# EAGLE schematic Terminierung_RS485_RJ45_Pads (EAGLE 8.5.1)
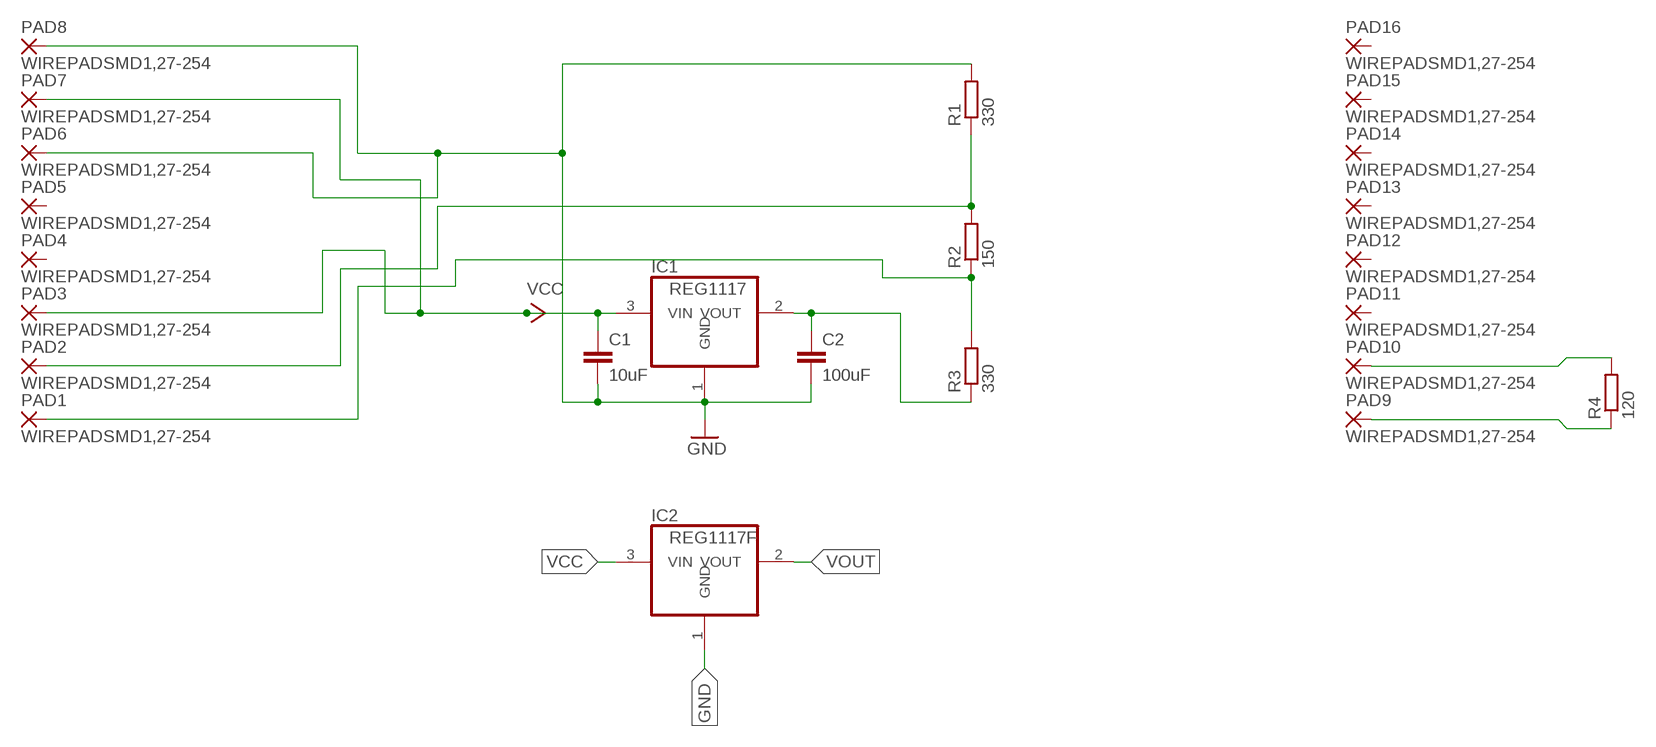
[diagram p0: schematic, sheet 1]

## Parts
C1  10uF  C-EUC0805K  [C0805K]
C2  100uF  C-EUC0805K  [C0805K]
IC1  REG1117  [SOT223]
IC2  REG1117F  [DD-3]
PAD1  WIREPADSMD1,27-254  [SMD1,27-2,54]
PAD2  WIREPADSMD1,27-254  [SMD1,27-2,54]
PAD3  WIREPADSMD1,27-254  [SMD1,27-2,54]
PAD4  WIREPADSMD1,27-254  [SMD1,27-2,54]
PAD5  WIREPADSMD1,27-254  [SMD1,27-2,54]
PAD6  WIREPADSMD1,27-254  [SMD1,27-2,54]
PAD7  WIREPADSMD1,27-254  [SMD1,27-2,54]
PAD8  WIREPADSMD1,27-254  [SMD1,27-2,54]
PAD9  WIREPADSMD1,27-254  [SMD1,27-2,54]
PAD10  WIREPADSMD1,27-254  [SMD1,27-2,54]
PAD11  WIREPADSMD1,27-254  [SMD1,27-2,54]
PAD12  WIREPADSMD1,27-254  [SMD1,27-2,54]
PAD13  WIREPADSMD1,27-254  [SMD1,27-2,54]
PAD14  WIREPADSMD1,27-254  [SMD1,27-2,54]
PAD15  WIREPADSMD1,27-254  [SMD1,27-2,54]
PAD16  WIREPADSMD1,27-254  [SMD1,27-2,54]
R1  330  R-EU_R0805  [R0805]
R2  150  R-EU_R0805  [R0805]
R3  330  R-EU_R0805  [R0805]
R4  120  R-EU_R0805  [R0805]

## Nets
GND: C1.2 C2.2 IC1.1(GND) IC2.1(GND) PAD6.1(P) PAD8.1(P) R1.2
N$1: PAD10.1(P) R4.2
N$2: PAD9.1(P) R4.1
N$3: PAD2.1(P) R1.1 R2.2
N$4: PAD1.1(P) R2.1 R3.2
VCC: C1.1 IC1.3(VIN) IC2.3(VIN) PAD3.1(P) PAD7.1(P)
VOUT: C2.1 IC1.2(VOUT) IC2.2(VOUT) R3.1
Unconnected: PAD4.1(P) PAD5.1(P) PAD11.1(P) PAD12.1(P) PAD13.1(P) PAD14.1(P) PAD15.1(P) PAD16.1(P)

## Library data of the parts
C1 C2 = resistor:C-EU: CAPACITOR, European symbol
IC1 = burr-brown:REG1117: 800mA and 1A Low Dropout (LDO) Positive Regulator 1.8V, 2.5V, 2.85V, 3.3V, 5V, and Adj; MPN: REG1117; OC_FARNELL: 1097566; OC_NEWARK: 14P6981
IC2 = burr-brown:REG1117: 800mA and 1A Low Dropout (LDO) Positive Regulator 1.8V, 2.5V, 2.85V, 3.3V, 5V, and Adj; MF: TEXAS INSTRUMENTS; MPN: REG1117FAKTTT; OC_FARNELL: 1296120; OC_NEWARK: 87H2562
PAD1-PAD16 = wirepad:WIREPAD: Wire PAD connect wire on PCB
R1-R4 = resistor:R-EU_: RESISTOR, European symbol